# Altium schematic sheet SEG_pressure gauge_up  V2.1.SchDoc
size A2
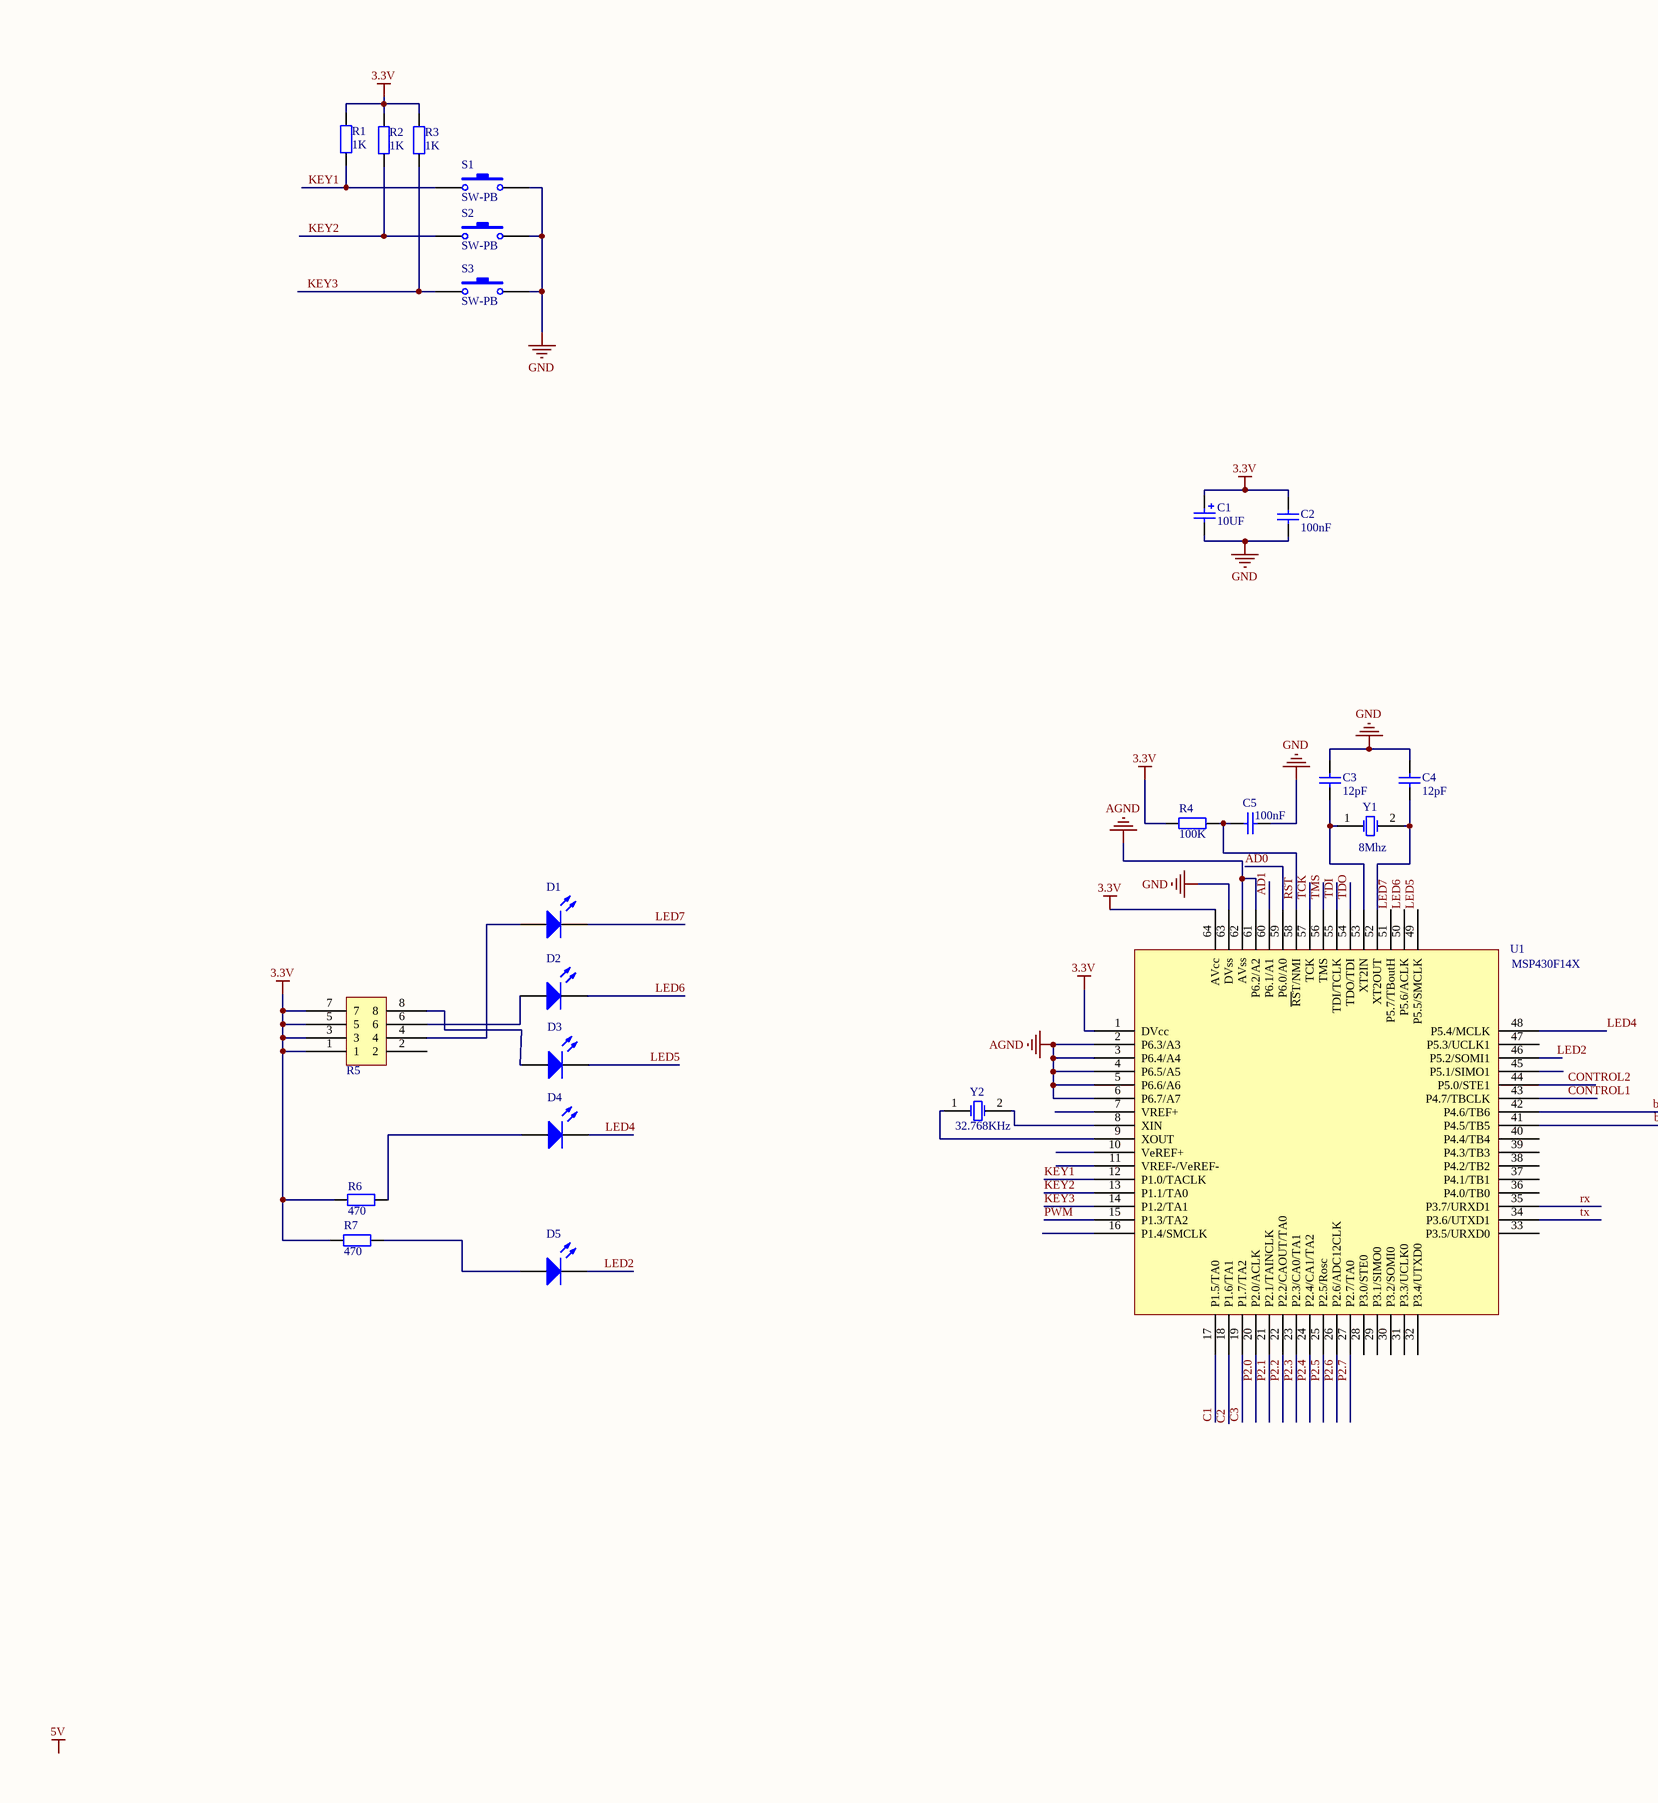
[diagram p0: SEG_pressure gauge_up  V2.1.SchDoc, left]
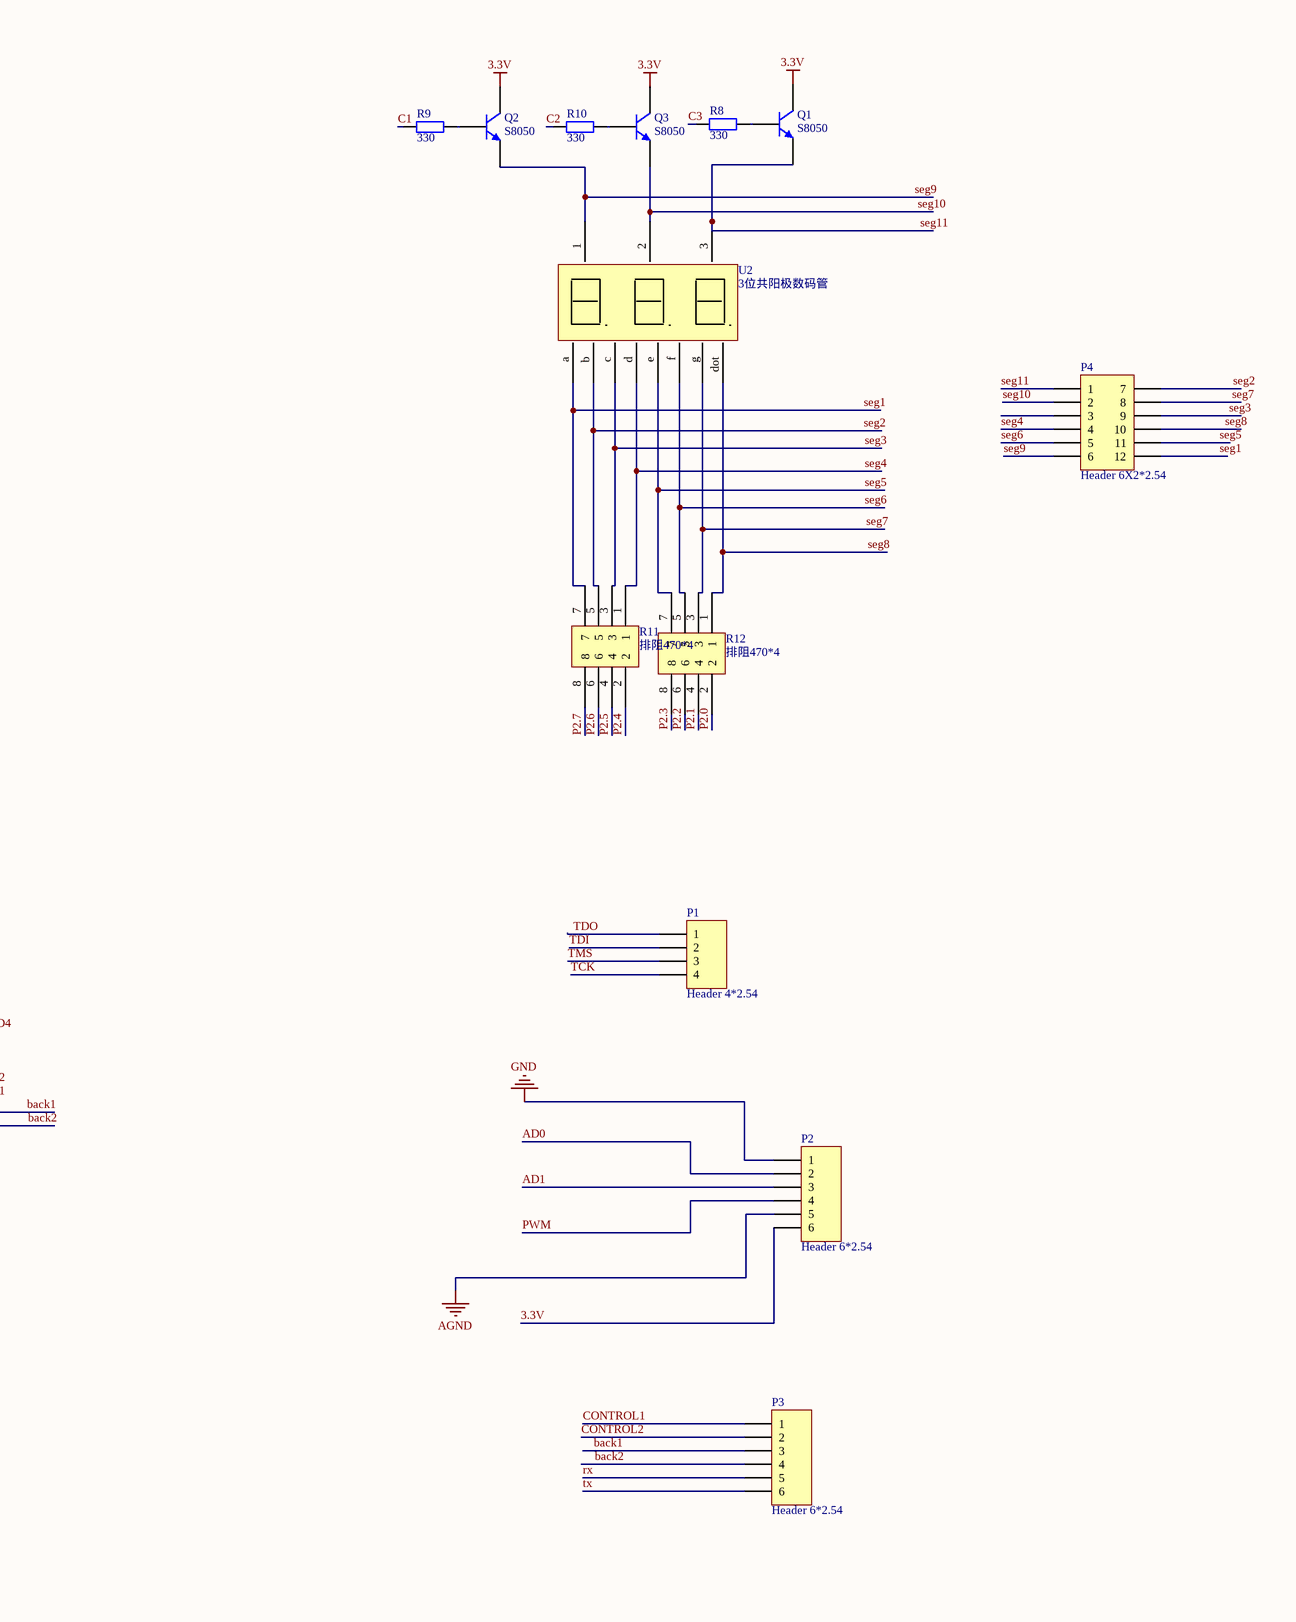
[diagram p1: SEG_pressure gauge_up  V2.1.SchDoc, right]

## Parts
C1  10uf  [3216]
C2  100nf  [0805_C_Y]
C3  12pf  [0805_C_Y]
C4  12pf  [0805_C_Y]
C5  100nf  [0805_C_Y]
D1  LED  [LED]  (value not drawn)
D2  LED  [LED]  (value not drawn)
D3  LED  [LED]  (value not drawn)
D4  LED  [LED]  (value not drawn)
D5  LED  [LED]  (value not drawn)
P1  Header 4*2.54  [HDR1X4]
P2  Header 6*2.54  [HDR1X6]
P3  Header 6*2.54  [HDR1X6]
P4  Header 6X2*2.54  [HDR2X6_CEN]
Q1  S8050  [SOT-23_Y]
Q2  S8050  [SOT-23_Y]
Q3  S8050  [SOT-23_Y]
R1  1k  [0805_R_Y]
R2  1k  [0805_R_Y]
R3  1k  [0805_R_Y]
R4  100k  [0805_R_Y]
R5  排阻470*4  [8P4R_0603]  (value not drawn)
R6  470  [0805_R_Y]
R7  470  [0805_R_Y]
R8  330  [0805_R_Y]
R9  330  [0805_R_Y]
R10  330  [0805_R_Y]
R11  排阻470*4  [8P4R_0603]
R12  排阻470*4  [8P4R_0603]
S1  SW-PB  [SW-SMD1]
S2  SW-PB  [SW-SMD1]
S3  SW-PB  [SW-SMD1]
U1  MSP430F14X  [S-PQFP-G64_Y]
U2  3位共阳极数码管  [3位数码管0.56]
Y1  value 8Mhz  [HC-49/S_Y]  (hidden comment: 晶振8M)
Y2  value 32.768KHz  [Crastal_32.768_Y]  (hidden comment: 晶振32.768k)

## Nets
3.3V: C1.1 C2.1 P2.6 Q1.3(C) Q2.3(C) Q3.3(C) R1.2 R2.2 R3.2 R4.1 R5.1 R5.3 R5.5 R5.7 R6.1 R7.1 U1.1(DVcc) U1.64(AVcc)
AGND: P2.5 U1.2(P6.3/A3) U1.3(P6.4/A4) U1.4(P6.5/A5) U1.5(P6.6/A6) U1.6(P6.7/A7) U1.61(P6.2/A2) U1.62(AVss)
GND: C1.2 C2.2 C3.1 C4.1 C5.1 P2.1 S1.2 S2.2 S3.2 U1.63(DVss)
AD0: P2.2 U1.59(P6.0/A0)
AD1: P2.3 U1.60(P6.1/A1)
back1: P3.3 U1.42(P4.6/TB6)
back2: P3.4 U1.41(P4.5/TB5)
C1: R9.2 U1.17(P1.5/TA0)
C2: R10.2 U1.18(P1.6/TA1)
C3: R8.2 U1.19(P1.7/TA2)
CONTROL1: P3.1 U1.43(P4.7/TBCLK)
CONTROL2: P3.2 U1.44(P5.0/STE1)
KEY1: R1.1 S1.1 U1.12(P1.0/TACLK)
KEY2: R2.1 S2.1 U1.13(P1.1/TA0)
KEY3: R3.1 S3.1 U1.14(P1.2/TA1)
LED2: D5.2(K) U1.46(P5.2/SOMI1)
LED4: D4.2(K) U1.48(P5.4/MCLK)
LED5: D3.2(K) U1.49(P5.5/SMCLK)
LED6: D2.2(K) U1.50(P5.6/ACLK)
LED7: D1.2(K) U1.51(P5.7/TBoutH)
P2.0: R12.2 U1.20(P2.0/ACLK)
P2.1: R12.4 U1.21(P2.1/TAINCLK)
P2.2: R12.6 U1.22(P2.2/CAOUT/TA0)
P2.3: R12.8 U1.23(P2.3/CA0/TA1)
P2.4: R11.2 U1.24(P2.4/CA1/TA2)
P2.5: R11.4 U1.25(P2.5/Rosc)
P2.6: R11.6 U1.26(P2.6/ADC12CLK)
P2.7: R11.8 U1.27(P2.7/TA0)
PWM: P2.4 U1.15(P1.3/TA2)
RST: C5.2 R4.2 U1.58(~{RS}T/NMI)
rx: P3.5 U1.35(P3.7/URXD1)
seg1: P4.12 R11.7 U2.a
seg2: P4.7 R11.5 U2.b
seg3: P4.9 R11.3 U2.c
seg4: P4.4 R11.1 U2.d
seg5: P4.11 R12.7 U2.e
seg6: P4.5 R12.5 U2.f
seg7: P4.8 R12.3 U2.g
seg8: P4.10 R12.1 U2.dot
seg9: P4.6 Q2.2(E) U2.1
seg10: P4.2 Q3.2(E) U2.2
seg11: P4.1 Q1.2(E) U2.3
TCK: P1.4 U1.57(TCK)
TDI: P1.2 U1.55(TDI/TCLK)
TDO: P1.1 U1.54(TDO/TDI)
TMS: P1.3 U1.56(TMS)
tx: P3.6 U1.34(P3.6/UTXD1)
NetC3_2: C3.2 U1.53(XT2IN) Y1.1(OSC1)
NetC4_2: C4.2 U1.52(XT2OUT) Y1.2(OSC2)
NetD1_1: D1.1(A) R5.4
NetD2_1: D2.1(A) R5.6
NetD3_1: D3.1(A) R5.8
NetD4_1: D4.1(A) R6.2
NetD5_1: D5.1(A) R7.2
NetQ1_1: Q1.1(B) R8.1
NetQ2_1: Q2.1(B) R9.1
NetQ3_1: Q3.1(B) R10.1
NetU1_8: U1.8(XIN) Y2.2(OSC2)
NetU1_9: U1.9(XOUT) Y2.1(OSC1)

Not connected (* = marked no-connect by the designer): P4 3; R5 2; U1 7(VREF+) 10(VeREF+) 11(VREF-/VeREF-) 16(P1.4/SMCLK) 28(P3.0/STE0) 29(P3.1/SIMO0) 30(P3.2/SOMI0) 31(P3.3/UCLK0) 32(P3.4/UTXD0) 33(P3.5/URXD0) 36(P4.0/TB0) 37(P4.1/TB1) 38(P4.2/TB2) 39(P4.3/TB3) 40(P4.4/TB4) 45(P5.1/SIMO1) 47(P5.3/UCLK1)

## Notes on the sheet
- Labels drawn without touching a wire or pin: 5V

## Library data of the parts
C1 = Cap Pol2: Polarized Capacitor (Axial); Published: 8-Jun-2000; LatestRevisionDate: 17-Jul-2002; LatestRevisionNote: Re-released for DXP Platform.; PackageReference: POLAR0.8; Publisher: Altium Limited; Value: 10UF
C2-C5 = Cap: Capacitor; Published: 8-Jun-2000; LatestRevisionDate: 17-Jul-2002; LatestRevisionNote: Re-released for DXP Platform.; PackageReference: RAD-0.3; Publisher: Altium Limited
  C2 C5: Value: 100nF
  C3 C4: Value: 12pF
D1-D5 = LED0: Typical INFRARED GaAs LED; Published: 8-Jun-2000; LatestRevisionDate: 08-Jul-2005; LatestRevisionNote: Mech Layer 1 removed.; PackageReference: LED-0; Publisher: Altium Limited
P1 = Header 4: Header, 4-Pin; LatestRevisionDate: 17-Jul-2002; LatestRevisionNote: Re-released for DXP Platform.; Publisher: Altium Limited
P2 P3 = Header 6: Header, 6-Pin; LatestRevisionDate: 17-Jul-2002; LatestRevisionNote: Re-released for DXP Platform.; Publisher: Altium Limited
P4 = Header 6X2A: Header, 6-Pin, Dual row; LatestRevisionDate: 17-Jul-2002; LatestRevisionNote: Re-released for DXP Platform.; Publisher: Altium Limited
Q1-Q3 = 2N3904: NPN General Purpose Amplifier; Published: 8-Jun-2000; LatestRevisionDate: 15-Jan-2003; LatestRevisionNote: PCB Footprint 'BCY-W3/D4.7' replaced; DatasheetVersion: 1997; PackageVersion: Sep-1998; PackageReference: TO-92A; Publisher: Altium Limited; Code_JEDEC: TO-92A; ComponentLink1Description: Manufacturer Link; ComponentLink1URL: http://www.fairchildsemi.com/; ComponentLink2Description: Datasheet; ComponentLink2URL: http://www.fairchildsemi.com/ds/2N%2F2N3904.pdf
R1-R4 R6-R10 = Res2: Resistor; Published: 8-Jun-2000; LatestRevisionDate: 17-Jul-2002; LatestRevisionNote: Re-released for DXP Platform.; PackageReference: AXIAL-0.4; Publisher: Altium Limited
  R1-R3: Value: 1K
  R4: Value: 100K
  R6 R7: Value: 470
  R8-R10: Value: 330
R5 R11 R12 = 排阻 8P4R: Value: 470
S1-S3 = SW-PB: Switch; Published: 24-Mar-1999; LatestRevisionDate: 17-Jul-2002; LatestRevisionNote: Re-released for DXP Platform.; PackageReference: SPST-2; Publisher: Altium Limited
Y1 Y2 = XTAL: Crystal Oscillator; Published: 8-Jun-2000; LatestRevisionDate: 17-Jul-2002; LatestRevisionNote: Re-released for DXP Platform.; PackageReference: R38; Publisher: Altium Limited